# Altium schematic sheet 0402CG100J500NT1_0402CG100J500NT.schdoc
size 124 x 101 mm
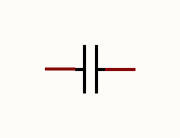
[diagram p0: 0402CG100J500NT1_0402CG100J500NT.schdoc]

## Parts
C?  10pF  [C0402]  (value not drawn)

## Nets

Not connected (* = marked no-connect by the designer): C? 1 2

## Library data of the parts
C? = 0402CG100J500NT: Manufacturer: FH(风华); Add into BOM: yes; Tolerance: ±5%; Voltage Rated: 50V; Temperature Coefficient: C0G; Symbol: 0402CG100J500NT; Device: 0402CG100J500NT; LCSC Part Name: 10pF ±5% 50V; Supplier Part: C1545; Manufacturer Part: 0402CG100J500NT; Supplier Footprint: 0402; JLCPCB Part Class: Extended Part; Datasheet: https://atta.szlcsc.com/upload/public/pdf/source/20200305/C486355_26A10D38EF8C2A5C37091D0039909270.pdf; Supplier: LCSC; Convert to PCB: yes; Value: 10pF